# EAGLE design PCB-BI8-2x4 (EAGLE 7.5.0)

## Sheet 1 of 2
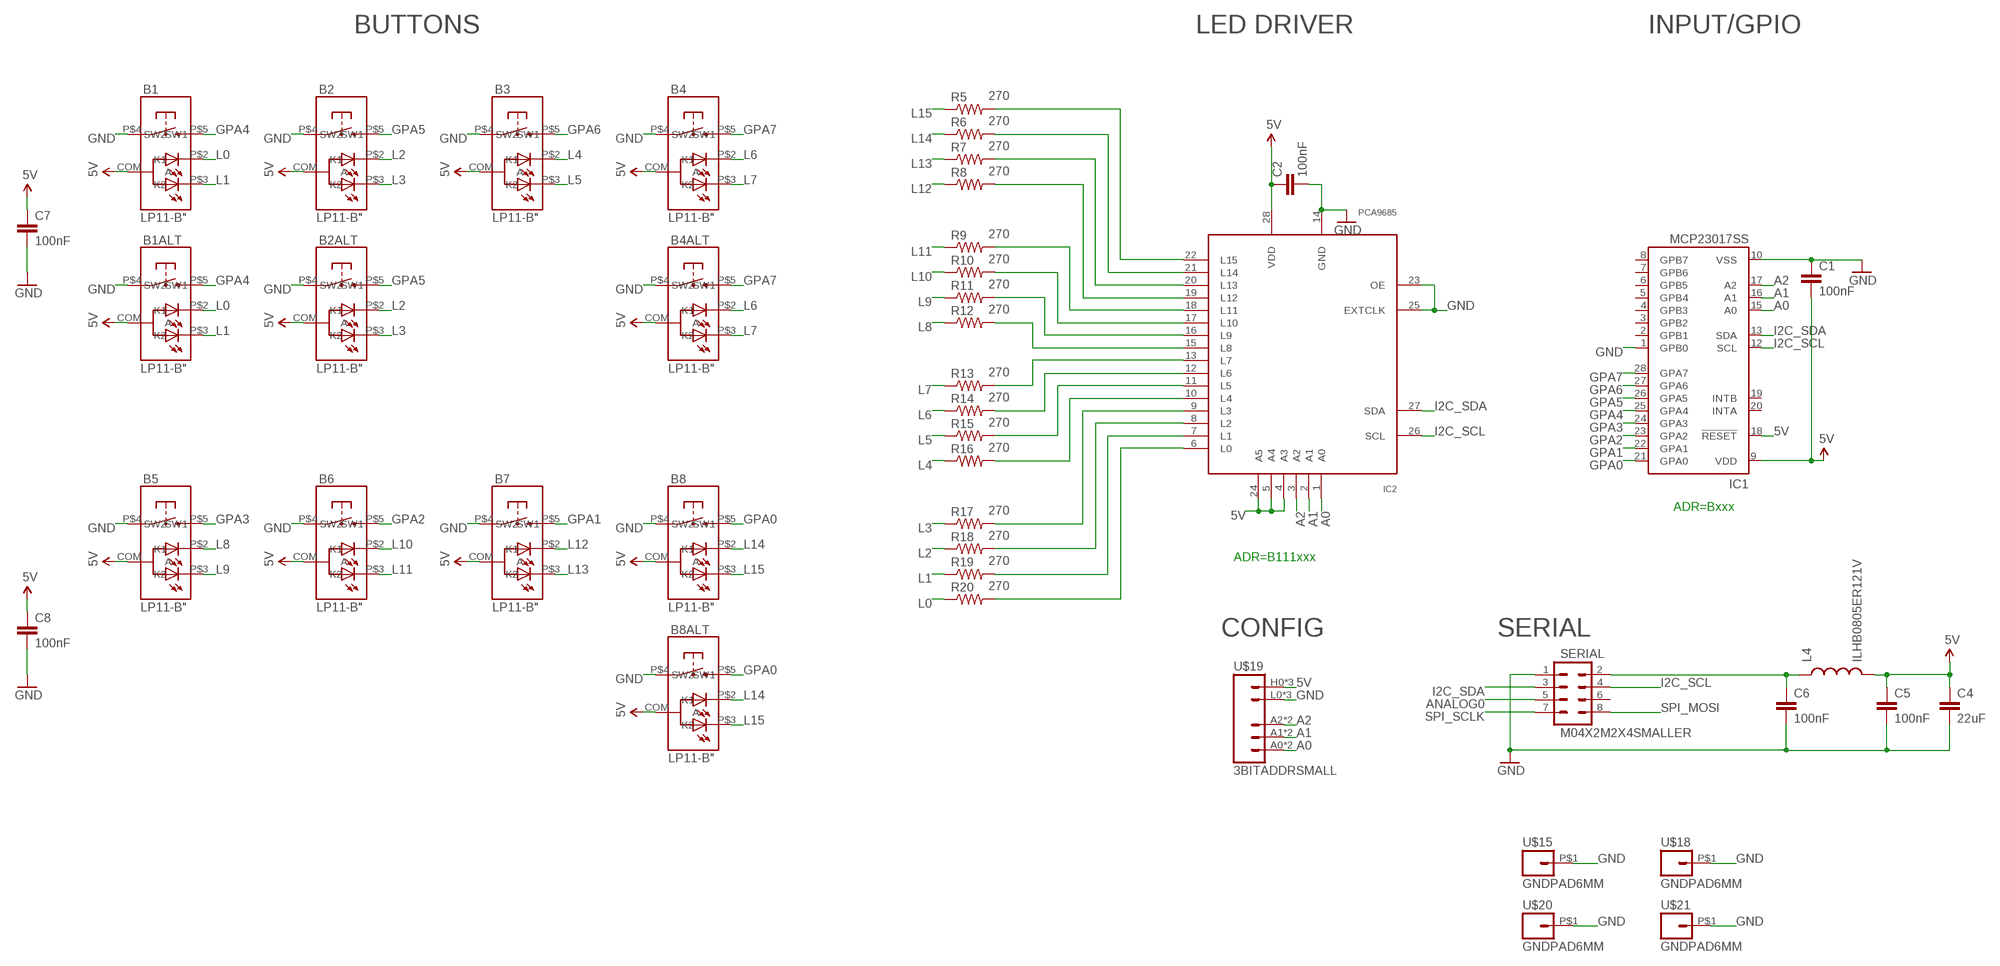
[diagram p0: schematic, sheet 1]

### Parts
B1  LP11-B"  [LP11]
B1ALT  LP11-B"  [LP11]
B2  LP11-B"  [LP11]
B2ALT  LP11-B"  [LP11]
B3  LP11-B"  [LP11]
B4  LP11-B"  [LP11]
B4ALT  LP11-B"  [LP11]
B5  LP11-B"  [LP11]
B6  LP11-B"  [LP11]
B7  LP11-B"  [LP11]
B8  LP11-B"  [LP11]
B8ALT  LP11-B"  [LP11]
C1  100nF  CAP0603-CAP  [0603-CAP]
C2  100nF  CAP0603-CAP  [0603-CAP]
C4  22uF  CAP0805  [0805]
C5  100nF  CAP0603-CAP  [0603-CAP]
C6  100nF  CAP0603-CAP  [0603-CAP]
C7  100nF  CAP0603-CAP  [0603-CAP]
C8  100nF  CAP0603-CAP  [0603-CAP]
IC1  MCP23017SS  [SSOP28]
IC2  PCA9685  [TSSOP28]
L4  ILHB0805ER121V  INDUCTOR0805  [0805]
R5  270  RESISTOR0603-RES  [0603-RES]
R6  270  RESISTOR0603-RES  [0603-RES]
R7  270  RESISTOR0603-RES  [0603-RES]
R8  270  RESISTOR0603-RES  [0603-RES]
R9  270  RESISTOR0603-RES  [0603-RES]
R10  270  RESISTOR0603-RES  [0603-RES]
R11  270  RESISTOR0603-RES  [0603-RES]
R12  270  RESISTOR0603-RES  [0603-RES]
R13  270  RESISTOR0603-RES  [0603-RES]
R14  270  RESISTOR0603-RES  [0603-RES]
R15  270  RESISTOR0603-RES  [0603-RES]
R16  270  RESISTOR0603-RES  [0603-RES]
R17  270  RESISTOR0603-RES  [0603-RES]
R18  270  RESISTOR0603-RES  [0603-RES]
R19  270  RESISTOR0603-RES  [0603-RES]
R20  270  RESISTOR0603-RES  [0603-RES]
SERIAL  M04X2M2X4SMALLER  [M2X4SMALLER]
U$15  GNDPAD6MM  [3.2MMPAD6MM]
U$18  GNDPAD6MM  [3.2MMPAD6MM]
U$19  3BITADDRSMALL  [3BITADDR_SMALL]
U$20  GNDPAD6MM  [3.2MMPAD6MM]
U$21  GNDPAD6MM  [3.2MMPAD6MM]

### Nets
5V [Power]: B1.COM(A) B1ALT.COM(A) B2.COM(A) B2ALT.COM(A) B3.COM(A) B4.COM(A) B4ALT.COM(A) B5.COM(A) B6.COM(A) B7.COM(A) B8.COM(A) B8ALT.COM(A) C1.2 C2.1 C4.1 C5.1 C7.1 C8.1 IC1.9(VDD) IC1.18(!RESET) IC2.4(A3) IC2.5(A4) IC2.24(A5) IC2.28(VDD) L4.2 U$19.H0(VCC) U$19.H1(VCC) U$19.H2(VCC)
A0: IC1.15(A0) IC2.1(A0) U$19.A0 U$19.AS0(A0)
A1: IC1.16(A1) IC2.2(A1) U$19.A1 U$19.AS1(A1)
A2: IC1.17(A2) IC2.3(A2) U$19.A2 U$19.AS2(A2)
ANALOG0: SERIAL.5
GND [Power]: B1.P$4(SW1) B1ALT.P$4(SW1) B2.P$4(SW1) B2ALT.P$4(SW1) B3.P$4(SW1) B4.P$4(SW1) B4ALT.P$4(SW1) B5.P$4(SW1) B6.P$4(SW1) B7.P$4(SW1) B8.P$4(SW1) B8ALT.P$4(SW1) C1.1 C2.2 C4.2 C5.2 C6.2 C7.2 C8.2 IC1.1(GPB0) IC1.10(VSS) IC2.14(GND) IC2.23(OE) IC2.25(EXTCLK) SERIAL.1 U$15.P$1 U$18.P$1 U$19.L0(GND) U$19.L1(GND) U$19.L2(GND) U$20.P$1 U$21.P$1
GPA0: B8.P$5(SW2) B8ALT.P$5(SW2) IC1.21(GPA0)
GPA1: B7.P$5(SW2) IC1.22(GPA1)
GPA2: B6.P$5(SW2) IC1.23(GPA2)
GPA3: B5.P$5(SW2) IC1.24(GPA3)
GPA4: B1.P$5(SW2) B1ALT.P$5(SW2) IC1.25(GPA4)
GPA5: B2.P$5(SW2) B2ALT.P$5(SW2) IC1.26(GPA5)
GPA6: B3.P$5(SW2) IC1.27(GPA6)
GPA7: B4.P$5(SW2) B4ALT.P$5(SW2) IC1.28(GPA7)
I2C_SCL: IC1.12(SCL) IC2.26(SCL) SERIAL.4
I2C_SDA: IC1.13(SDA) IC2.27(SDA) SERIAL.3
L0: B1.P$2(K1) B1ALT.P$2(K1) R20.1
L1: B1.P$3(K2) B1ALT.P$3(K2) R19.1
L2: B2.P$2(K1) B2ALT.P$2(K1) R18.1
L3: B2.P$3(K2) B2ALT.P$3(K2) R17.1
L4: B3.P$2(K1) R16.1
L5: B3.P$3(K2) R15.1
L6: B4.P$2(K1) B4ALT.P$2(K1) R14.1
L7: B4.P$3(K2) B4ALT.P$3(K2) R13.1
L8: B5.P$2(K1) R12.1
L9: B5.P$3(K2) R11.1
L10: B6.P$2(K1) R10.1
L11: B6.P$3(K2) R9.1
L12: B7.P$2(K1) R8.1
L13: B7.P$3(K2) R7.1
L14: B8.P$2(K1) B8ALT.P$2(K1) R6.1
L15: B8.P$3(K2) B8ALT.P$3(K2) R5.1
N$1 [Power]: C6.1 L4.1 SERIAL.2
N$4: IC2.13(L7) R13.2
N$5: IC2.12(L6) R14.2
N$7: IC2.11(L5) R15.2
N$9: IC2.10(L4) R16.2
N$10: IC2.9(L3) R17.2
N$11: IC2.8(L2) R18.2
N$12: IC2.7(L1) R19.2
N$19: IC2.6(L0) R20.2
N$20: IC2.15(L8) R12.2
N$21: IC2.16(L9) R11.2
N$22: IC2.17(L10) R10.2
N$23: IC2.18(L11) R9.2
N$24: IC2.19(L12) R8.2
N$25: IC2.20(L13) R7.2
N$26: IC2.21(L14) R6.2
N$27: IC2.22(L15) R5.2
SPI_MOSI: SERIAL.8
SPI_SCLK: SERIAL.7
Unconnected: IC1.2(GPB1) IC1.3(GPB2) IC1.4(GPB3) IC1.5(GPB4) IC1.6(GPB5) IC1.7(GPB6) IC1.8(GPB7) IC1.19(INTB) IC1.20(INTA) SERIAL.6

### Notes on the sheet
- BUTTONS | LED DRIVER | INPUT/GPIO
- ADR=Bxxx
- ADR=B111xxx
- CONFIG | SERIAL

## Sheet 2 of 2

## Library data of the parts
B1 B1ALT B2 B2ALT B3 B4 B4ALT B5-B8 B8ALT = SKAARHOJ:LP11-B
C1 C2 C4-C8 = SparkFun:CAP: Capacitor Standard 0603 ceramic capacitor, and 0.1" leaded capacitor.
IC1 = microchip:MCP23017: http://ww1.microchip.com/downloads/en/DeviceDoc/21952a.pdf Source: http://ww1.microchip.com/downloads/en/DeviceDoc/21952a.pdf; MF: MICROCHIP; MPN: MCP23017-E/SS; OC_FARNELL: 1467674; OC_NEWARK: 31K2960
IC2 = wsmith:PCA9685
L4 = SparkFun:INDUCTOR: Inductors Basic Inductor/Choke - 0603 and 1206. Footprints are not proven and vary greatly between part numbers.
R5-R20 = SparkFun:RESISTOR: Resistor Basic schematic elements and footprints for 0603, 1206, and PTH resistors.
SERIAL = SKAARHOJ:M04X2
U$15 U$18 U$20 U$21 = SKAARHOJ:GNDPAD
U$19 = SKAARHOJ:3BITADDR

## Net classes
0 default: width 0.203 mm, drill 0.406 mm, clearance 0.203 mm
1 Power: width 0.406 mm, drill 0.61 mm, clearance 0.203 mm

## Board
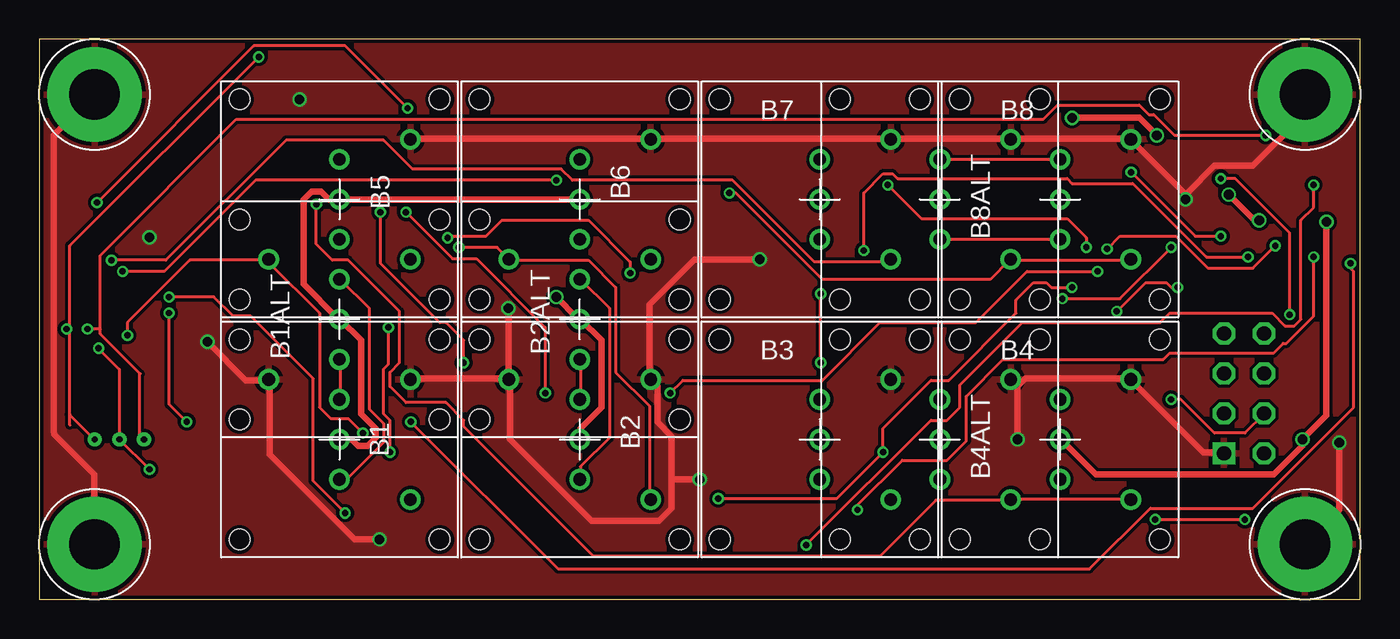
[diagram p1: board, top side]
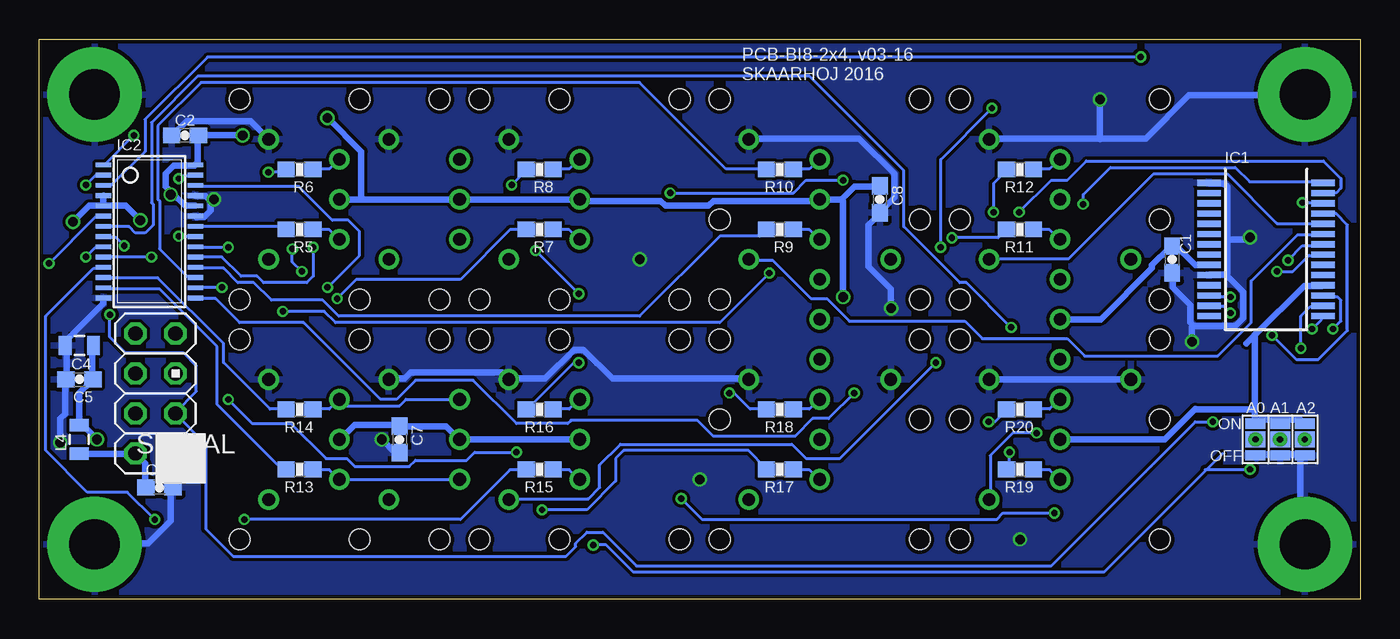
[diagram p2: board, bottom side, seen from below]

Size 83.82 x 35.56 mm. Coordinates in mm from the lower left corner, seen from the top.
Outline: 0,0 83.82,0 83.82,35.56 0,35.56 0,0
Copper layers (1*16): Top 0.035mm / dielectric 1.5mm / Bottom 0.035mm
Design rules "Fusion_eagle_rule_v1.1": minimum track width 6mil, minimum drill 12mil, track to track 6mil, track to pad 6mil, pad to pad 6mil, via to via 6mil, smd to smd 0mil, copper to edge 10mil, drill to drill 10mil, minimum pad ring 10mil, minimum via ring 6mil, stop-mask expansion 2mil, vias tented up to drill 100mil, thermal gap 10mil

### Footprints (pad centres in the part's own frame; a part is rotated, then mirrored left to right if it is on the bottom)
LP11 = drill 0.8: COM 0,0; P$2 0,2.54; P$3 0,-2.54; P$4 4.5,3.81; P$5 4.5,-3.81 | hole 1.3: -6.35,6.35; 6.35,6.35; 6.35,-6.35; -6.35,-6.35
0603-CAP = smd 1.1 x 1: 1 -0.85,0; 2 0.85,0
0805 = smd 0.8 x 1.2: 1 -0.9,0; 2 0.9,0
SSOP28 = smd 0.4 x 1.5: 1 -4.225,-3.625; 2 -3.575,-3.625; 3 -2.925,-3.625; 4 -2.275,-3.625; 5 -1.625,-3.625; 6 -0.975,-3.625; 7 -0.325,-3.625; 8 0.325,-3.625; 9 0.975,-3.625; 10 1.625,-3.625; 11 2.275,-3.625; 12 2.925,-3.625; 13 3.575,-3.625; 14 4.225,-3.625; 15 4.225,3.625; 16 3.575,3.625; 17 2.925,3.625; 18 2.275,3.625; 19 1.625,3.625; 20 0.975,3.625; 21 0.325,3.625; 22 -0.325,3.625; 23 -0.975,3.625; 24 -1.625,3.625; 25 -2.275,3.625; 26 -2.925,3.625; 27 -3.575,3.625; 28 -4.225,3.625
TSSOP28 = smd 0.305 x 0.991: 1 -4.225,-2.918; 2 -3.575,-2.918; 3 -2.925,-2.918; 4 -2.275,-2.918; 5 -1.625,-2.918; 6 -0.975,-2.918; 7 -0.325,-2.918; 8 0.325,-2.918; 9 0.975,-2.918; 10 1.625,-2.918; 11 2.275,-2.918; 12 2.925,-2.918; 13 3.575,-2.918; 14 4.225,-2.918; 15 4.225,2.918; 16 3.575,2.918; 17 2.925,2.918; 18 2.275,2.918; 19 1.625,2.918; 20 0.975,2.918; 21 0.325,2.918; 22 -0.325,2.918; 23 -0.975,2.918; 24 -1.625,2.918; 25 -2.275,2.918; 26 -2.925,2.918; 27 -3.575,2.918; 28 -4.225,2.918
0603-RES = smd 1.1 x 1: 1 -0.85,0; 2 0.85,0
M2X4SMALLER = drill 0.9 square: 1 -1.27,3.81 | drill 0.9 octagon: 2 1.27,3.81; 3 -1.27,1.27; 4 1.27,1.27; 5 -1.27,-1.27; 6 1.27,-1.27; 7 -1.27,-3.81; 8 1.27,-3.81
3.2MMPAD6MM = drill 3.2 pad 6: P$1 0,0
3BITADDR_SMALL = drill 0.4: A0 -1.565,0; A1 0,0; A2 1.565,0 | smd 1.27 x 1: AS0 -1.565,0; AS1 0,0; AS2 1.565,0 | smd 1.27 x 0.635: H0 -1.565,1; H1 0,1; H2 1.565,1; L0 -1.565,-1; L1 0,-1; L2 1.565,-1

### Placement (x,y rotation side)
B1  19.05,10.16 0 top
B1ALT  19.05,17.78 180 top
B2  34.29,10.16 0 top
B2ALT  34.29,17.78 180 top
B3  49.53,10.16 0 top
B4  64.77,10.16 0 top
B4ALT  57.15,10.16 0 top
B5  19.05,25.4 0 top
B6  34.29,25.4 0 top
B7  49.53,25.4 0 top
B8  64.77,25.4 0 top
B8ALT  57.15,25.4 0 top
C1  11.94,21.59 90 bottom
C2  74.57,29.46 180 bottom
C4  81.28,16.13 180 bottom
C5  81.28,13.97 180 bottom
C6  76.2,7.11 0 bottom
C7  60.96,10.16 270 bottom
C8  30.48,25.4 270 bottom
IC1  5.97,22.23 270 bottom
IC2  76.83,23.37 270 bottom
L4  81.28,10.16 90 bottom
R5  67.31,23.5 180 bottom
R6  67.31,27.3 180 bottom
R7  52.07,23.5 180 bottom
R8  52.07,27.3 180 bottom
R9  36.83,23.5 180 bottom
R10  36.83,27.3 180 bottom
R11  21.59,23.5 180 bottom
R12  21.59,27.3 180 bottom
R13  67.31,8.26 180 bottom
R14  67.31,12.06 180 bottom
R15  52.07,8.26 180 bottom
R16  52.07,12.06 180 bottom
R17  36.83,8.26 180 bottom
R18  36.83,12.06 180 bottom
R19  21.59,8.26 180 bottom
R20  21.59,12.06 180 bottom
SERIAL  76.45,13.08 180 bottom
U$15  3.5,3.5 0 top
U$18  80.32,3.5 0 top
U$19  5.08,10.16 0 bottom
U$20  3.5,32.06 0 top
U$21  80.32,32.06 0 top

### Tracks (layer width: path | path; a pad name or v marks a point on that pad's centre or on a via)
5V  (via drill 0.61)
  Top 0.406: v77.42,24.08 77.11,24.08 v75.49,25.7 | B4.COM 64.82,10.16 67.06,7.92 78.33,7.92 80.16,9.75 v80.16,10.16 81.69,11.68 v81.69,23.98 | B2.COM 34.34,10.16 34.34,10.87 35.66,12.19 35.66,16.46 34.34,17.78 B2ALT.COM 34.14,17.88 v32.82,19.2 | B1.COM 19.81,10.16 20.22,9.75 20.83,9.75 21.34,10.26 21.34,10.87 20.42,11.79 20.42,16.46 19.1,17.78 B1ALT.COM 18.9,17.88 16.76,20.02 16.76,25.4 17.27,25.91 17.88,25.91 18.39,25.4 B5.COM B6.COM | v70.92,29.46 69.8,30.58 v65.53,30.58
  Bottom 0.406: B3.COM B4ALT.COM 57.2,10.16 58.01,10.97 60.96,10.97 C7.1 61.06,11.07 63.8,11.07 64.72,10.16 B4.COM | IC2.5 79.76,25.6 IC2.4 | 75.39,25.81 75.79,26.21 75.79,27.03 75.29,27.53 73.97,27.53 IC2.28 73.76,27.64 73.76,29.46 C2.1 v70.92,29.46 | 75.39,25.81 74.57,24.99 73.97,24.99 IC2.24 | v77.42,24.08 78.33,24.99 79.55,24.99 IC2.5 | v75.49,25.7 75.39,25.81 | C4.1 80.47,16.05 80.47,14.02 C5.1 80.57,13.82 81.28,13.11 L4.2 81.18,10.97 80.97,10.97 v80.16,10.16 | v81.69,23.98 80.67,24.99 79.96,24.99 IC2.5 | 63.4,25.4 B8ALT.COM B7.COM 49.38,25.3 44.4,25.3 44.09,24.99 41.35,24.99 41.05,25.3 34.44,25.3 B6.COM 32.92,25.4 | 63.4,25.4 B8.COM | 7.21,16.26 6.66,16.82 | 6.66,16.82 3.56,19.91 2.44,19.91 IC1.18 | 32.92,25.4 32.11,26.21 30.48,26.21 C8.1 | IC1.9 9.65,21.23 10.46,21.23 11.58,22.35 11.89,22.35 C1.2 12.09,22.35 13.21,21.23 13.21,21.03 16.46,17.78 B1ALT.COM | 10.48,12.07 12.39,10.16 B1.COM | 10.48,12.07 10.46,12.09 | v32.82,19.2 32.82,25.3 32.92,25.4 | v65.53,30.58 63.4,28.45 63.4,25.4 | 5.08,11.43 3.81,11.43 U$19.H2 | 5.08,11.43 6.35,11.43 U$19.H0 6.67,11.43 6.67,12.06 | 5.08,11.43 U$19.H1 | 6.67,12.06 6.67,16.83 6.66,16.82 | 6.67,12.06 10.48,12.06 10.48,12.07
A0  (via drill 0.41)
  Top 0.203: v77.83,29.46 72.03,29.46 70.71,30.79 70.41,30.79 69.8,31.39 64.62,31.39 63.7,30.48 12.5,30.48 3.86,21.84 3.86,17.17 | 3.86,17.17 3.86,16.87 6.39,14.33 | 6.4,14.33 6.39,14.33 | 3.86,17.17 v3.05,17.17 | U$19.AS0 6.35,10.16 6.35,14.29 6.39,14.33
  Bottom 0.203: v77.83,29.46 79.65,27.64 IC2.1 | v3.05,17.17 2.44,17.78 2.44,17.98 IC1.15 | 6.67,10.16 U$19.AS0
A1  (via drill 0.41)
  Top 0.203: v80.87,26.31 80.87,24.89 80.06,24.08 80.06,17.78 79.65,17.37 79.05,17.37 78.23,18.19 71.73,18.19 71.12,17.58 62.38,17.58 58.42,13.61 58.42,12.19 57.61,11.38 56.59,11.38 v48.67,3.45 | v3.76,15.95 3.81,15.88 5.08,14.61 U$19.AS1 v6.99,8.26
  Bottom 0.203: v80.87,26.31 80.26,26.92 79.76,26.92 IC2.2 | v48.67,3.45 47.85,3.45 46.13,1.73 16.26,1.73 9.79,8.2 | 8.74,9.25 9.79,8.2 | v3.76,15.95 3.76,17.98 3.15,18.59 2.44,18.59 IC1.16 | v6.99,8.26 9.84,8.26 9.79,8.2
A2  (via drill 0.41)
  Top 0.203: v13.92,34.44 1.93,22.45 1.93,17.17 | 1.93,11.07 1.93,11.75 | 1.93,11.75 1.93,17.17 | 1.93,17.17 v1.73,17.17 | U$19.AS2 3.49,10.16 1.91,11.75 1.93,11.75
  Bottom 0.203: v13.92,34.44 73.15,34.44 77.11,30.48 77.11,28.45 79.25,26.31 79.65,26.31 IC2.3 | v1.73,17.17 1.22,17.68 1.22,19 1.42,19.2 2.34,19.2 IC1.17 | 3.81,10.16 U$19.AS2
GND  (via drill 0.6, 0.61)
  Top 0.406: v82.5,9.96 82.5,5.69 80.37,3.56 U$18.P$1 | v62.08,10.16 62.08,13.51 61.67,13.92 B4ALT.P$4 62.18,13.61 62.59,14.02 69.19,14.02 B4.P$4 69.39,13.82 73.86,9.35 75.18,9.35 SERIAL.1 | B1.P$4 23.57,14.02 29.77,14.02 B2ALT.P$4 | 40.13,7.62 40.13,10.36 39.22,11.28 39.22,13.51 38.81,13.92 B2.P$4 38.73,13.97 38.73,18.73 41.59,21.59 v45.72,21.59 | 40.13,7.62 40.13,5.79 39.32,4.98 35.05,4.98 29.87,10.16 29.87,13.82 B2ALT.P$4 | v10.67,16.36 13.11,13.92 14.53,13.92 B1ALT.P$4 14.61,13.97 14.61,9.21 20,3.81 v21.59,3.81 | 3.45,3.56 U$15.P$1 3.49,3.81 3.49,7.94 0.95,10.48 0.91,10.67 0.91,29.46 3.45,32 U$20.P$1 | B5.P$4 23.57,29.26 38.71,29.26 B6.P$4 38.91,29.26 53.85,29.26 B7.P$4 54.05,29.26 61.57,29.26 B8ALT.P$4 61.77,29.26 69.09,29.26 B8.P$4 69.29,29.16 72.75,25.7 v72.75,25.4 72.85,25.81 74.57,27.53 77.01,27.53 80.26,30.79 80.26,32 U$21.P$1 | v29.77,18.49 29.77,14.22 B2ALT.P$4 | 40.13,7.62 v41.91,7.62
  Bottom 0.406: SERIAL.1 75.18,9.25 75.29,9.14 75.29,7.11 C6.2 75.49,7.01 75.49,4.98 76.91,3.56 80.26,3.56 U$18.P$1 | IC2.14 79.76,19.1 79.76,18.8 82.09,16.46 82.09,16.15 C4.2 82.09,15.95 82.09,14.02 C5.2 82.19,13.82 82.19,11.79 82.5,11.48 v82.5,9.96 | v62.08,10.16 61.27,9.35 60.96,9.35 C7.2 | B2.P$4 38.81,14.02 47.45,14.02 49.28,15.85 49.89,15.85 51.71,14.02 53.95,14.02 B3.P$4 54.15,14.12 54.46,14.43 60.25,14.43 60.66,14.02 61.57,14.02 B4ALT.P$4 | 10.57,17.37 10.77,17.58 10.77,18.69 11.89,19.81 11.89,20.73 C1.1 | 10.57,17.37 7.92,17.37 7.42,17.88 7.42,19.51 8.53,20.62 | 8.53,20.62 9.55,20.62 IC1.10 | 8.43,22.86 8.43,20.73 8.53,20.62 | 8.43,22.86 8.43,26.21 8.64,26.42 9.55,26.42 IC1.1 | v10.67,16.36 10.67,17.27 10.57,17.37 | B6.P$4 38.71,29.26 31.8,29.26 29.57,27.03 29.57,25.5 30.48,24.59 C8.2 30.58,24.38 31.19,23.77 31.19,21.13 29.77,19.71 v29.77,18.49 | 72.95,25.3 72.95,24.69 73.36,24.28 73.86,24.28 IC2.23 | 72.95,25.3 73.25,25.6 73.86,25.6 IC2.25 | C2.2 75.39,29.46 74.47,30.38 70.41,30.38 69.29,29.26 B8.P$4 | v72.75,25.4 72.85,25.4 72.95,25.3 | 16.51,29.26 23.47,29.26 B5.P$4 | 16.51,29.26 13.61,29.26 10.87,32 3.56,32 U$20.P$1 | 8.43,22.86 6.99,22.86 v6.99,22.99 | 5.08,9.21 3.81,9.21 U$19.L2 3.81,8.89 3.81,3.81 U$15.P$1 | 5.08,9.21 6.35,9.21 U$19.L0 | 5.08,9.21 U$19.L1 | 16.51,29.26 v16.51,31.75 | 16.51,29.21 16.51,29.26 | B1.P$4 B1ALT.P$4
  pour Top: 0,0 83.82,0 83.82,35.56 0,35.56
  pour Bottom: 0,0 83.82,0 83.82,35.56 0,35.56
GPA0  (via drill 0.41)
  Top 0.203: v5.28,20.83 7.92,20.83 13.72,26.62 v32.82,26.62 | v43.79,25.81 44.2,25.81 49.68,20.32 60.35,20.32 61.57,21.54 B8ALT.P$5 61.67,21.54 69.19,21.54 B8.P$5
  Bottom 0.203: v5.28,20.83 4.27,20.83 3.25,21.84 2.44,21.84 IC1.21 | v32.82,26.62 35.15,26.62 35.97,25.81 v43.79,25.81
GPA1  (via drill 0.41)
  Top 0.203: v4.57,21.54 8.03,21.54 15.65,29.16 21.84,29.16 23.67,27.33 33.12,27.33 33.83,26.62 43.99,26.62 49.17,21.44 53.85,21.44 53.95,21.54 B7.P$5
  Bottom 0.203: v4.57,21.54 3.66,22.45 2.44,22.45 IC1.22
GPA2
  Bottom 0.203: IC1.23 2.44,23.16 3.96,23.16 6.91,20.22 6.91,17.58 9.04,15.44 17.48,15.44 18.59,16.56 23.98,16.56 25.09,17.68 32.41,17.68 33.83,19.1 34.85,19.1 37.29,21.54 38.71,21.54 B6.P$5
GPA3
  Bottom 0.203: IC1.24 2.44,23.88 5.28,23.88 8.43,27.03 13.11,27.03 18.49,21.64 23.47,21.64 B5.P$5
GPA4  (via drill 0.41)
  Top 0.203: v5.59,16.76 5.59,17.58 9.55,21.54 14.53,21.54 B1ALT.P$5 14.53,21.44 17.78,18.19 17.78,12.19 18.49,11.48 19.61,11.48 v20.52,10.57
  Bottom 0.203: v5.59,16.76 4.06,15.24 2.64,15.24 0.81,17.07 0.81,23.77 1.52,24.49 2.34,24.49 IC1.25 | v20.52,10.57 22.05,10.57 23.47,9.14 23.47,6.4 B1.P$5
GPA5  (via drill 0.41)
  Top 0.203: v3.66,25.2 13.61,35.15 19.41,35.15 v23.37,31.19 | v26.62,22.35 29.06,22.35 29.77,21.64 B2ALT.P$5 29.87,21.54 34.85,21.54 36.58,19.81 36.58,14.43 38.71,12.29 38.71,6.4 B2.P$5
  Bottom 0.203: v3.66,25.2 2.44,25.2 IC1.26 | v23.37,31.19 26.62,27.94 v26.62,22.35
GPA6  (via drill 0.41)
  Top 0.203: v21.64,24.59 21.64,21.34 25.4,17.58 25.81,17.58 26.92,16.46 v26.92,15.04
  Bottom 0.203: v21.64,24.59 19.61,26.62 18.59,26.62 17.37,27.84 2.34,27.84 1.22,26.72 1.22,26.11 1.52,25.81 IC1.27 | v26.92,15.04 33.02,8.94 35.15,8.94 36.07,9.86 46.94,9.86 48.26,8.53 48.26,7.11 48.97,6.4 53.95,6.4 B3.P$5
GPA7  (via drill 0.41)
  Top 0.203: v17.58,25.09 17.58,22.55 18.59,21.54 19.61,21.54 22.86,18.29 22.86,15.04 22.25,14.43 22.25,13.51 23.27,12.5 25.81,12.5 26.92,11.38 26.92,10.97 35.15,2.74 53.34,2.74 56.9,6.3 61.57,6.3 B4ALT.P$5 61.67,6.4 69.19,6.4 B4.P$5
  Bottom 0.203: v17.58,25.09 17.58,25.7 15.85,27.43 7.92,27.43 7.01,26.52 2.44,26.52 IC1.28
I2C_SCL  (via drill 0.41)
  Top 0.203: v65.53,19.81 64.21,19.81 63.91,20.12 63.09,20.12 61.98,19 61.98,18.19 57.71,13.92 56.59,13.92 53.54,10.87 v53.54,9.35 50.6,6.4 v43.08,6.4 | v71.83,12.7 72.44,12.7 74.57,10.57 76.5,10.57 77.72,11.79 SERIAL.4 | v8.23,19.2 11.07,19.2 12.29,17.98 13.41,17.98 17.37,14.02 17.37,7.52 v19.41,5.49
  Bottom 0.203: v65.53,19.81 63.5,21.84 63.5,23.37 64.21,24.08 65.23,24.08 67.36,26.21 73.86,26.21 IC2.26 | v53.54,9.35 56.19,9.35 56.69,8.84 59.94,8.84 60.35,8.43 63.8,8.43 64.31,8.94 65.63,8.94 67.87,11.18 70.31,11.18 v71.83,12.7 | v8.23,19.2 9.55,19.2 IC1.12 | v19.41,5.49 22.66,5.49 23.06,5.08 41.76,5.08 v43.08,6.4
I2C_SDA  (via drill 0.41)
  Top 0.203: v74.98,26.72 75.89,26.72 79.35,23.27 v79.35,18.09 | v8.23,18.19 8.23,12.39 v9.35,11.28
  Bottom 0.203: v74.98,26.72 74.78,26.92 73.97,26.92 IC2.27 | v79.35,18.09 79.35,16.66 78.33,15.65 74.68,15.65 73.86,14.83 73.86,13.21 75.18,11.89 SERIAL.3 75.18,11.79 73.25,9.86 73.25,4.47 71.53,2.74 50.39,2.74 49.78,3.35 49.78,3.56 49.07,4.27 48.06,4.27 45.92,2.13 19.61,2.13 10.46,11.28 v9.35,11.28 | v8.23,18.19 8.64,18.59 9.55,18.59 IC1.13
L0
  Top 0.203: B1.P$2 19.1,12.7 19.1,15.24 B1ALT.P$2
  Bottom 0.203: R20.1 20.73,12.09 19.71,12.09 19.1,12.7 B1.P$2
L1
  Top 0.203: B1.P$3 19.51,7.62 21.84,9.96 21.84,11.18 20.93,12.09 20.93,18.49 19.1,20.32 B1ALT.P$3
  Bottom 0.203: R19.1 20.73,8.23 19.71,8.23 19.1,7.62 B1.P$3
L2
  Top 0.203: B2.P$2 34.34,12.7 34.34,15.24 B2ALT.P$2
  Bottom 0.203: R18.1 35.97,12.09 34.95,12.09 34.34,12.7 B2.P$2
L3
  Top 0.203: B2.P$3 34.34,7.62 34.34,8.43 36.17,10.26 36.17,18.49 34.34,20.32 B2ALT.P$3
  Bottom 0.203: R17.1 35.97,8.23 34.95,8.23 34.34,7.62 B2.P$3
L4
  Bottom 0.203: R16.1 51.21,12.09 50.19,12.09 49.58,12.7 B3.P$2
L5
  Bottom 0.203: R15.1 51.21,8.23 50.19,8.23 49.58,7.62 B3.P$3
L6
  Bottom 0.203: R14.1 66.45,12.09 65.43,12.09 64.82,12.7 B4.P$2 64.72,12.7 64.31,12.29 60.96,12.29 60.55,12.7 B4ALT.P$2
L7
  Bottom 0.203: R13.1 66.45,8.23 65.43,8.23 64.82,7.62 B4.P$3 B4ALT.P$3
L8
  Bottom 0.203: R12.1 20.73,27.33 19.71,27.33 19.1,27.94 B5.P$2
L9
  Bottom 0.203: R11.1 20.73,23.47 19.71,23.47 19.1,22.86 B5.P$3
L10
  Bottom 0.203: R10.1 35.97,27.33 34.95,27.33 34.34,27.94 B6.P$2
L11
  Bottom 0.203: R9.1 35.97,23.47 34.95,23.47 34.34,22.86 B6.P$3
L12
  Bottom 0.203: R8.1 51.21,27.33 50.19,27.33 49.58,27.94 B7.P$2
L13
  Bottom 0.203: R7.1 51.21,23.47 50.19,23.47 49.58,22.86 B7.P$3
L14
  Top 0.203: B8.P$2 B8ALT.P$2
  Bottom 0.203: R6.1 66.45,27.33 65.43,27.33 64.82,27.94 B8.P$2
L15
  Top 0.203: B8.P$3 B8ALT.P$3
  Bottom 0.203: R5.1 66.45,23.47 65.43,23.47 64.82,22.86 B8.P$3
N$1
  Bottom 0.406: C6.1 77.11,7.11 77.11,8.64 77.72,9.25 SERIAL.2 77.83,9.25 81.28,9.25 L4.1
N$4
  Bottom 0.203: IC2.13 79.65,19.71 76.2,19.71 72.54,16.05 72.54,12.39 68.48,8.33 68.17,8.33 R13.2
N$5
  Bottom 0.203: IC2.12 79.65,20.42 76.3,20.42 72.14,16.26 72.14,15.04 69.19,12.09 68.17,12.09 R14.2
N$7  (via drill 0.41)
  Top 0.203: v70.81,5.08 v76.5,5.08
  Bottom 0.203: v76.5,5.08 78.23,6.81 80.77,6.81 83.41,9.45 83.41,17.98 80.37,21.03 79.76,21.03 IC2.11 | v70.81,5.08 57.1,5.08 53.95,8.23 52.93,8.23 R15.2
N$9  (via drill 0.41)
  Top 0.203: v76.71,21.74 74.07,21.74 69.39,26.42 65.53,26.42 65.23,26.72 54.46,26.72 54.15,27.03 53.54,27.03 52.32,25.81 v52.32,22.15 | v49.58,15.04 v49.58,19.41
  Bottom 0.203: v76.71,21.74 79.65,21.74 IC2.10 | v49.58,19.41 v52.32,22.15 | v49.58,15.04 49.89,15.04 52.83,12.09 R16.2
N$10  (via drill 0.41)
  Top 0.203: v80.87,21.74 80.87,17.98 79.15,16.26 78.94,16.26 78.33,15.65 71.73,15.65 71.32,15.24 61.16,15.24 58.83,12.9 58.83,10.06 57.61,8.84 54.76,8.84 51.92,5.99 v51.92,5.69
  Bottom 0.203: v80.87,21.74 80.26,22.35 79.76,22.35 IC2.9 | v51.92,5.69 49.07,5.69 47.24,7.52 47.24,8.94 46.74,9.45 38.81,9.45 37.69,8.33 R17.2
N$11  (via drill 0.41)
  Top 0.203: v78.44,22.45 77.01,21.03 74.17,21.03 72.14,23.06 68.58,23.06 v67.77,22.25 | v67.16,20.83 62.69,20.83 59.44,17.58 53.34,17.58 49.68,13.92 40.84,13.92 v40.03,13.11
  Bottom 0.203: v78.44,22.45 78.94,22.96 79.65,22.96 IC2.8 | v67.77,22.25 67.77,21.44 v67.16,20.83 | v40.03,13.11 39.73,13.11 38.71,12.09 37.69,12.09 R18.2
N$12  (via drill 0.41)
  Top 0.203: v22.15,17.27 22.15,14.94 21.84,14.63 21.84,11.79 22.25,11.38 v22.25,9.35
  Bottom 0.203: v22.15,17.27 24.99,20.12 25.4,20.12 28.96,23.67 28.96,27.23 34.95,33.22 73.76,33.22 76.71,30.28 76.71,25.2 76.61,25.09 76.61,23.77 77.11,23.27 77.72,23.27 78.13,23.67 79.65,23.67 IC2.7 | v22.25,9.35 22.25,8.43 22.35,8.33 R19.2
N$19  (via drill 0.41)
  Top 0.203: v83.21,21.34 83.21,21.03 83.41,20.83 83.41,12.19 77.01,5.79 70.51,5.79 66.65,1.93 32.92,1.93 v23.57,11.28
  Bottom 0.203: v83.21,21.34 80.26,24.28 79.76,24.28 IC2.6 | v23.57,11.28 23.16,11.28 22.45,11.99 R20.2
N$20  (via drill 0.41)
  Top 0.203: v32.11,13.11 32.11,17.27 27.74,21.64 26.21,21.64 v23.27,24.59
  Bottom 0.203: v32.11,13.11 33.73,11.48 34.75,11.48 35.87,10.36 41.05,10.36 42.06,11.38 50.09,11.38 50.29,11.18 53.54,11.18 56.29,13.92 59.94,13.92 61.16,12.7 62.18,12.7 67.06,17.58 71.12,17.58 72.64,19.1 73.86,19.1 IC2.15 | v23.27,24.59 23.27,26.42 22.45,27.23 R12.2
N$21  (via drill 0.41)
  Top 0.203: v72.24,19.81 71.83,19.81 71.53,20.12 70.21,20.12 v68.38,18.29 | v37.49,20.73 37.49,21.44 34.85,24.08 29.36,24.08 28.35,23.06 26.01,23.06 v25.91,22.96
  Bottom 0.203: v72.24,19.81 73.86,19.81 IC2.16 | v68.38,18.29 65.73,18.29 65.02,17.58 40.64,17.58 v37.49,20.73 | v25.91,22.96 22.96,22.96 22.45,23.47 R11.2
N$22
  Bottom 0.203: IC2.17 73.97,20.52 74.47,20.52 76.2,22.25 76.2,25.3 76.3,25.4 76.3,30.07 73.56,32.82 45.72,32.82 40.23,27.33 37.69,27.33 R10.2
N$23
  Bottom 0.203: IC2.18 73.86,21.03 72.14,21.03 71.22,20.12 70.21,20.12 69.09,19 65.84,19 64.82,17.98 45.72,17.98 40.64,23.06 38.1,23.06 37.69,23.47 R9.2
N$24  (via drill 0.41)
  Top 0.203: v66.45,22.35 66.45,22.96 65.23,24.18 55.98,24.18 v53.85,26.31
  Bottom 0.203: v66.45,22.35 66.45,20.52 66.85,20.12 69.6,20.12 70,20.52 71.02,20.52 72.24,21.74 73.86,21.74 IC2.19 | v53.85,26.31 52.93,27.23 R8.2
N$25  (via drill 0.41)
  Top 0.203: v71.83,22.35 68.58,19.1 v64.92,19.1
  Bottom 0.203: v71.83,22.35 73.86,22.35 IC2.20 | v64.92,19.1 63.7,20.32 57.1,20.32 53.95,23.47 52.93,23.47 R7.2
N$26  (via drill 0.41)
  Top 0.203: v74.98,23.06 73.36,23.06 v69.29,27.13
  Bottom 0.203: v74.98,23.06 73.97,23.06 IC2.21 | v69.29,27.13 68.28,27.13 68.17,27.23 R6.2
N$27
  Bottom 0.203: IC2.22 73.86,23.67 68.28,23.67 68.17,23.57 R5.2

### Text on the board
_bsilk: PCB-BI8-2x4, v03-16 / SKAARHOJ 2016